# Altium schematic sheet Port_Deployable_Headers.SchDoc: Port_Deployable_Headers
size Letter; Author: Nicholas J. Sorensen, and Erik F. Halliwell; Engineer: Nicholas J. Sorensen, and Erik F. HalliwellNicholas Sorensen, and Erik Halliwell; DocumentNumber: 8; SheetNumber: 8; SheetTotal: 8
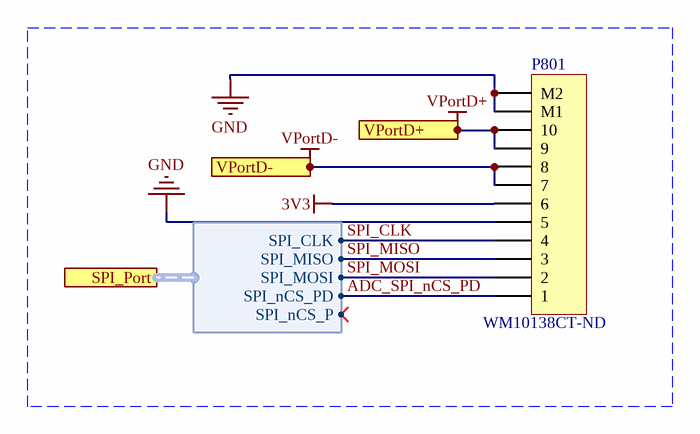
[diagram p0: Port_Deployable_Headers.SchDoc]

## Parts
P801  WM10138CT-ND  [MOLX-5040501091]

## Ports
SPI_Port (harness SPI_Port), VPortD+, VPortD-

## Harnesses
SPI_Port: SPI_CLK, SPI_MISO, SPI_MOSI, SPI_nCS_PD, SPI_nCS_P

## Nets
3V3: P801.6
GND: P801.5 P801.M1 P801.M2
VPortD+: P801.9 P801.10 ; port VPortD+
VPortD-: P801.7 P801.8 ; port VPortD-
ADC_SPI_nCS_PD: P801.1 ; port SPI_Port.SPI_nCS_PD
SPI_CLK: P801.4 ; port SPI_Port.SPI_CLK
SPI_MISO: P801.3 ; port SPI_Port.SPI_MISO
SPI_MOSI: P801.2 ; port SPI_Port.SPI_MOSI

## Notes on the sheet
- (the "License"); you may not use or redistribute this file except in compliance with the License. You
- This file and the information within it are licensed under the terms of the Apache License, Version 2.0
- Copyright
- Unless required by applicable law or agreed to in writing, content distributed under the License is
- distributed on an "AS IS" BASIS, WITHOUT WARRANTIES OR CONDITIONS OF ANY KIND,
- either express or implied. See the License for the specific language governing permissions and
- limitations under the License.
- may obtain a copy of the License at:
- http://www.apache.org/licenses/LICENSE-2.0
- Title
- Size:
- Date:
- Letter
- Number:
- Time:
- Revision:
- Sheet
- of
- University of Alberta
- Deptartment of Electrical
- and Computer Engineering
- Edmonton AB, Canada
- T6G 1H9
- File:

## Library data of the parts
P801 = 69: CONN HEADER SMD R/A 10POS 1.5MM; Part Number: 69; Manufacturer Part Number: 5040501091; Designator: P?; LatestRevisionDate: 17-Jul-2002; LatestRevisionNote: Re-released for DXP Platform.; Publisher: Altium Limited; Supplier Part Number 1: WM10138CT-ND; Supplier 1: Digi-Key; Supplier Link: #https://www.digikey.ca/product-detail/en/molex/5040501091/WM10138CT-ND/4357655#